# EAGLE design main_board__PT (EAGLE 7.7.0)
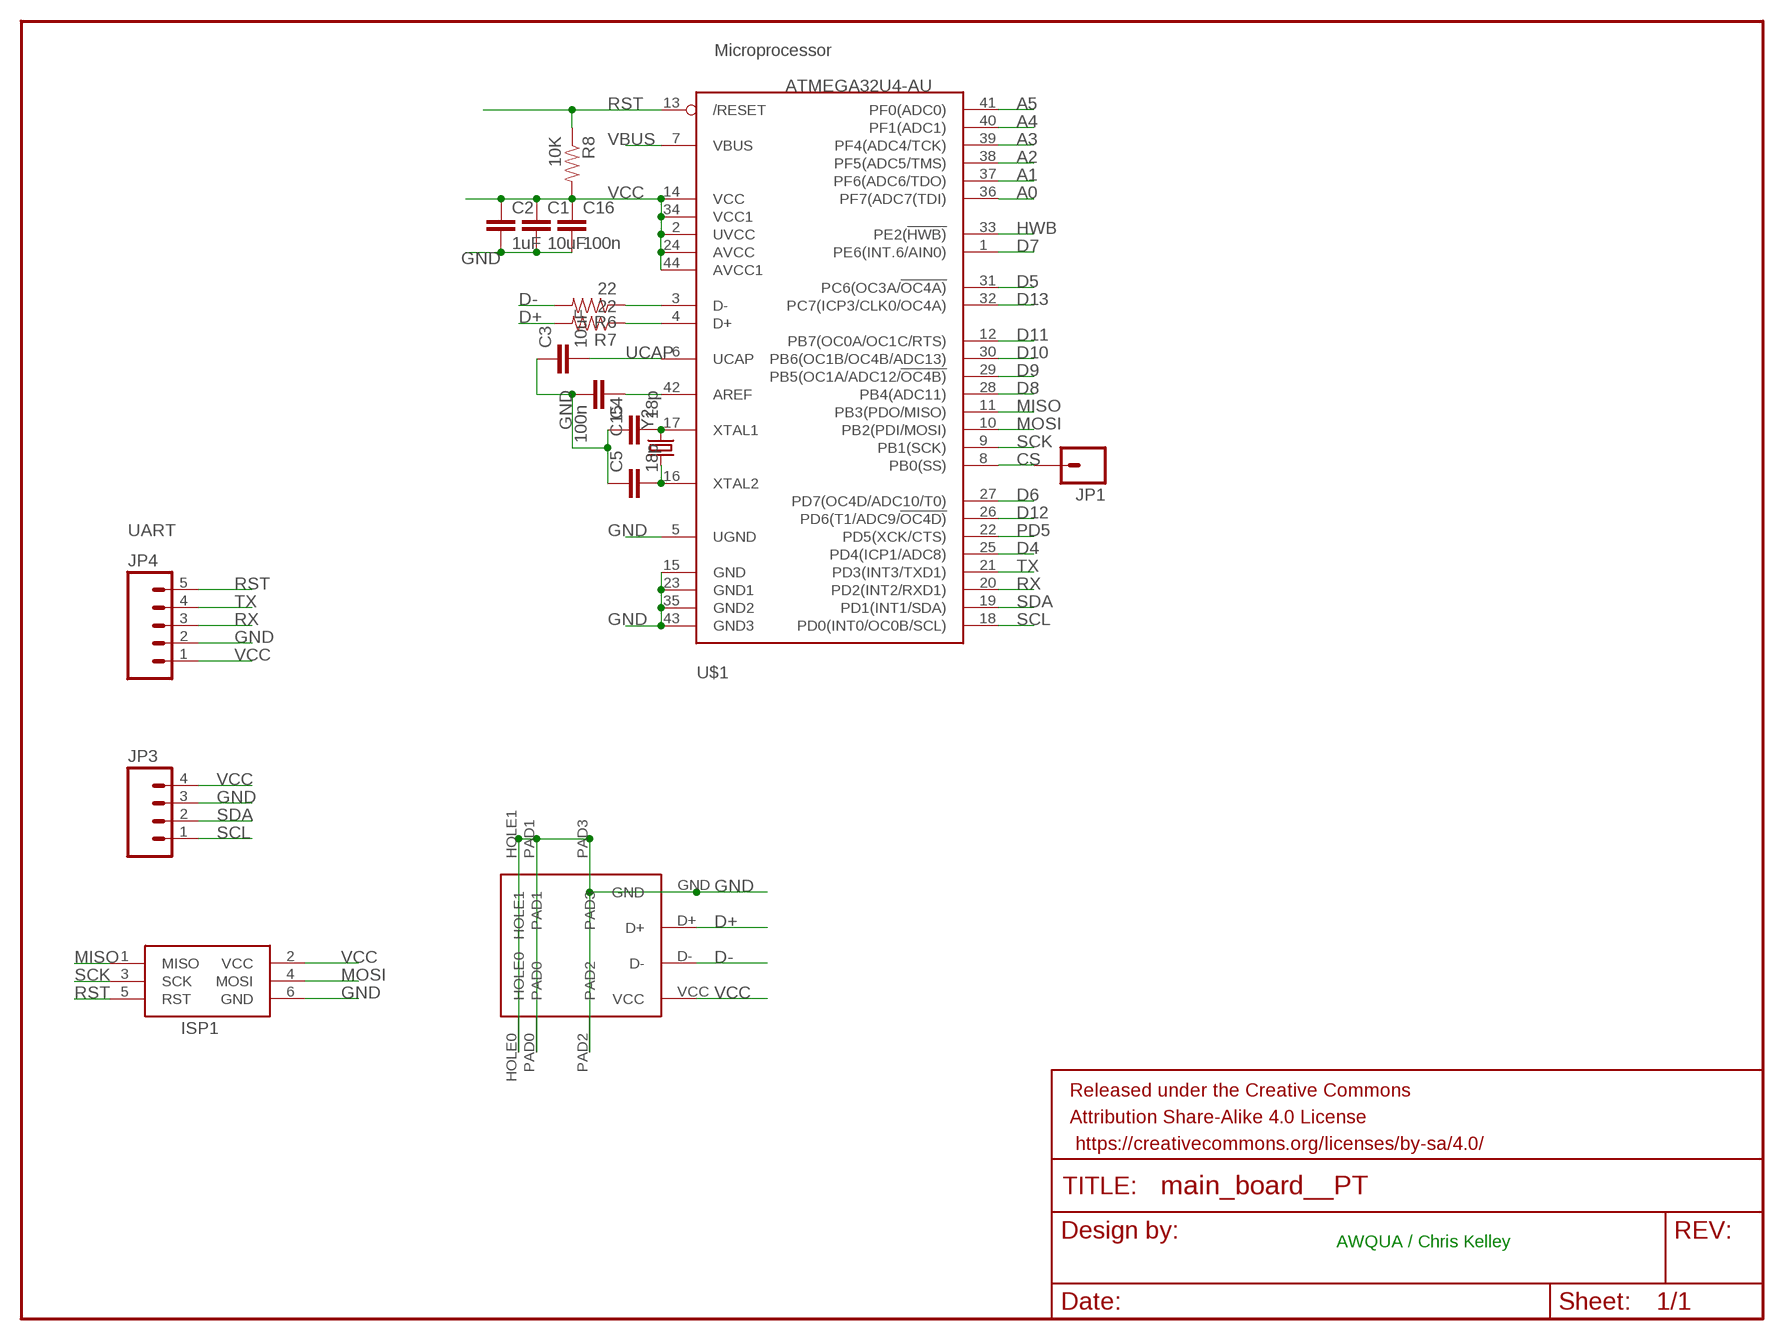
[diagram p0: schematic, sheet 1]

## Parts
C1  10uF  CAP0603-CAP  [0603-CAP]
C2  1uF  CAP0603-CAP  [0603-CAP]
C3  10uF  CAP0603-CAP  [0603-CAP]
C4  18p  CAP0603-CAP  [0603-CAP]
C5  18p  CAP0603-CAP  [0603-CAP]
C15  100n  CAP0603-CAP  [0603-CAP]
C16  100n  CAP0603-CAP  [0603-CAP]
FRAME2  FRAME-LETTER  [CREATIVE_COMMONS]
ISP1  AVRISP-6  [AVRISP]
JP1  M01PTH  [1X01]
JP3  M04PTH  [1X04]
JP4  M05PTH  [1X05]
R6  22  RESISTOR0603  [0603-RES]
R7  22  RESISTOR0603  [0603-RES]
R8  10K  RESISTORPTH-1/6W  [1/6W-RES]
U$1  ATMEGA32U4-AU  [TQFP44]
U$2  USBMICRO-10118193-0001LF  [USBMICRO-10118193-0001LF]
Y2  CRYSTAL5X3  [CRYSTAL-SMD-5X3]

## Nets
A0: U$1.36(PF7(ADC7(TDI))
A1: U$1.37(PF6(ADC6/TDO))
A2: U$1.38(PF5(ADC5/TMS))
A3: U$1.39(PF4(ADC4/TCK))
A4: U$1.40(PF1(ADC1))
A5: U$1.41(PF0(ADC0))
CS: JP1.1 U$1.8(PB0(SS))
D4: U$1.25(PD4(ICP1/ADC8))
D5: U$1.31(PC6(OC3A/!OC4A))
D6: U$1.27(PD7(OC4D/ADC10/T0))
D7: U$1.1(PE6(INT.6/AIN0))
D8: U$1.28(PB4(ADC11))
D9: U$1.29(PB5(OC1A/ADC12/!OC4B))
D10: U$1.30(PB6(OC1B/OC4B/ADC13))
D11: U$1.12(PB7(OC0A/OC1C/RTS))
D12: U$1.26(PD6(T1/ADC9/!OC4D))
D13: U$1.32(PC7(ICP3/CLK0/OC4A))
D+: R7.2 U$2.D+
D-: R6.2 U$2.D-
GND: C1.2 C2.2 C3.1 C4.1 C5.1 C15.2 C16.2 ISP1.6(GND) JP3.3 JP4.2 U$1.5(UGND) U$1.15(GND) U$1.23(GND1) U$1.35(GND2) U$1.43(GND3) U$2.GND U$2.HOLE0 U$2.HOLE1 U$2.PAD0 U$2.PAD1 U$2.PAD2 U$2.PAD3
HWB: U$1.33(PE2(!HWB))
MISO: ISP1.1(MISO) U$1.11(PB3(PDO/MISO))
MOSI: ISP1.4(MOSI) U$1.10(PB2(PDI/MOSI))
N$41: R6.1 U$1.3(D-)
N$42: R7.1 U$1.4(D+)
N$44: C15.1 U$1.42(AREF)
N$45: C4.2 U$1.17(XTAL1) Y2.3
N$46: C5.2 U$1.16(XTAL2) Y2.1
PD5: U$1.22(PD5(XCK/CTS))
RST: ISP1.5(RST) JP4.5 R8.1 U$1.13(/RESET)
RX: JP4.3 U$1.20(PD2(INT2/RXD1))
SCK: ISP1.3(SCK) U$1.9(PB1(SCK))
SCL: JP3.1 U$1.18(PD0(INT0/OC0B/SCL))
SDA: JP3.2 U$1.19(PD1(INT1/SDA))
TX: JP4.4 U$1.21(PD3(INT3/TXD1))
UCAP: C3.2 U$1.6(UCAP)
VBUS: U$1.7(VBUS)
VCC: C1.1 C2.1 C16.1 ISP1.2(VCC) JP3.4 JP4.1 R8.2 U$1.2(UVCC) U$1.14(VCC) U$1.24(AVCC) U$1.34(VCC1) U$1.44(AVCC1) U$2.VCC

## Notes on the sheet
- Microprocessor
- UART
- AWQUA / Chris Kelley

## Library data of the parts
C1-C5 C15 C16 = SparkFun:CAP: Capacitor Standard 0603 ceramic capacitor, and 0.1" leaded capacitor.
FRAME2 = SparkFun-Aesthetics:FRAME-LETTER: Schematic Frame Standard 8.5x11 US Letter frame
ISP1 = adafruit:AVRISP: AVR ISP HEADER Standard 6 pin header for AVR programming
JP1 = SparkFun-Connectors:M01: Header 1 Standard 1-pin 0.1" header. Use with straight break away headers (SKU : PRT-00116), right angle break away headers (PRT-00553), swiss pins (PRT-00743), machine pins (PRT-00117), and female headers (PRT-00115).
JP3 = SparkFun-Connectors:M04: Header 4 Standard 4-pin 0.1" header. Use with straight break away headers (SKU : PRT-00116), right angle break away headers (PRT-00553), swiss pins (PRT-00743), machine pins (PRT-00117), and female headers (PRT-00115). Molex polarized connector foot print use with SKU : PRT-08231 with associated crimp pins and housings. 1MM SMD Version SKU: PRT-10208
JP4 = SparkFun-Connectors:M05: Header 5 Standard 5-pin 0.1" header. Use with straight break away headers (SKU : PRT-00116), right angle break away headers (PRT-00553), swiss pins (PRT-00743), machine pins (PRT-00117), and female headers (PRT-00115). Molex polarized connector foot print use with SKU : PRT-08230 with associated crimp pins and housings.
R6-R8 = SparkFun-Resistors:RESISTOR: Resistor Basic schematic elements and footprints for 0603, 1206, and PTH resistors.
U$1 = adafruit:ATMEGA32U4: http://www.ladyada.net/library/eagle
U$2 = awqua_eagle_library:USBMICRO-10118193-0001LF
Y2 = SparkFun:CRYSTAL: Crystals Various standard crystals. Proven footprints. Spark Fun Electronics SKU : COM-00534

## Board
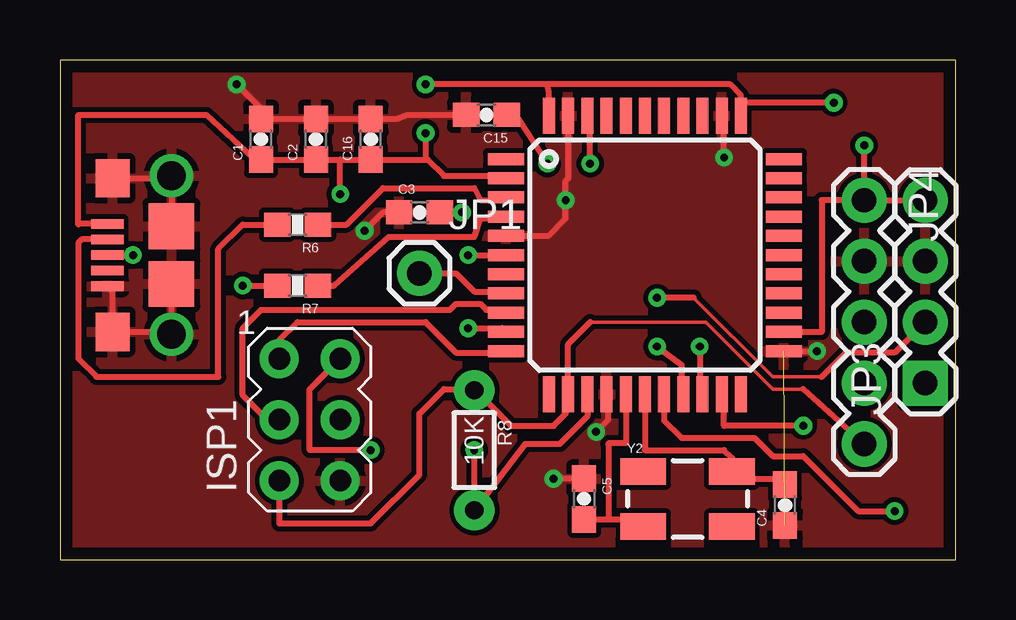
[diagram p1: board, top side]
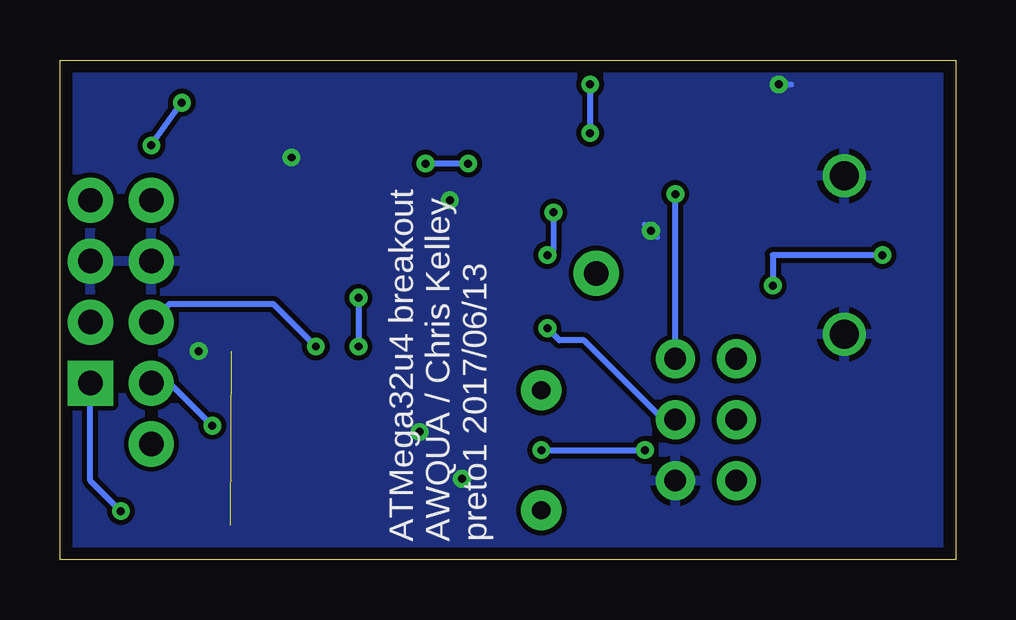
[diagram p2: board, bottom side, seen from below]

Size 37.34 x 20.83 mm. Coordinates in mm from the lower left corner, seen from the top.
Outline: 0,0 37.34,0 37.34,20.83 0,20.83 0,0
Copper layers (1*16): Top 0.035mm / dielectric 1.5mm / Bottom 0.035mm
Design rules "default *": minimum track width 6mil, minimum drill 12mil, track to track 8mil, track to pad 8mil, pad to pad 8mil, via to via 8mil, smd to smd 8mil, copper to edge 20mil, drill to drill 8mil, minimum pad ring 10mil, minimum via ring 8mil, stop-mask expansion 4mil, vias tented up to drill 13mil, thermal gap 10mil

### Footprints (pad centres in the part's own frame; a part is rotated, then mirrored left to right if it is on the bottom)
0603-CAP = smd 1.1 x 1: 1 -0.85,0; 2 0.85,0
AVRISP = drill 0.9 pad 1.626: 1 -1.27,2.54; 2 1.27,2.54; 3 -1.27,0; 4 1.27,0; 5 -1.27,-2.54; 6 1.27,-2.54
1X01 = drill 1.016 pad 1.88: 1 0,0
1X04 = drill 1.016 pad 1.88 square: 1 0,0 | drill 1.016 pad 1.88: 2 2.54,0; 3 5.08,0; 4 7.62,0
1X05 = drill 1.016 pad 1.88: 1 0,0; 2 2.54,0; 3 5.08,0; 4 7.62,0; 5 10.16,0
0603-RES = smd 1.1 x 1: 1 -0.85,0; 2 0.85,0
1/6W-RES = drill 0.762 pad 1.676: 1 -2.5,0; 2 2.5,0
TQFP44 = smd 1.5 x 0.5: 1 -5.8,4; 2 -5.8,3.2; 3 -5.8,2.4; 4 -5.8,1.6; 5 -5.8,0.8; 6 -5.8,0; 7 -5.8,-0.8; 8 -5.8,-1.6; 9 -5.8,-2.4; 10 -5.8,-3.2; 11 -5.8,-4; 23 5.8,-4; 24 5.8,-3.2; 25 5.8,-2.4; 26 5.8,-1.6; 27 5.8,-0.8; 28 5.8,0; 29 5.8,0.8; 30 5.8,1.6; 31 5.8,2.4; 32 5.8,3.2; 33 5.8,4 | smd 0.5 x 1.5: 12 -4,-5.8; 13 -3.2,-5.8; 14 -2.4,-5.8; 15 -1.6,-5.8; 16 -0.8,-5.8; 17 0,-5.8; 18 0.8,-5.8; 19 1.6,-5.8; 20 2.4,-5.8; 21 3.2,-5.8; 22 4,-5.8; 34 4,5.8; 35 3.2,5.8; 36 2.4,5.8; 37 1.6,5.8; 38 0.8,5.8; 39 0,5.8; 40 -0.8,5.8; 41 -1.6,5.8; 42 -2.4,5.8; 43 -3.2,5.8; 44 -4,5.8
USBMICRO-10118193-0001LF = smd 0.4 x 1.35: D+ 0,4.125; D- 0.65,4.125; DNP -0.65,4.125; GND -1.3,4.125; VCC 1.3,4.125 | drill 1.2 pad 1.6: HOLE0 3.3,1.45; HOLE1 -3.3,1.45 | smd 1.9 x 1.9: PAD0 1.2,1.45; PAD1 -1.2,1.45 | smd 1.6 x 1.4: PAD2 3.2,3.9; PAD3 -3.2,3.9
CRYSTAL-SMD-5X3 = smd 1.9 x 1.1: 1 -1.85,-1.15; 2 1.85,-1.15; 3 1.85,1.15; 4 -1.85,1.15

### Placement (x,y rotation side)
C1  8.38,17.53 90 top
C2  10.67,17.53 90 top
C3  14.99,14.48 0 top
C4  30.23,2.29 90 top
C5  21.84,2.54 270 top
C15  17.78,18.54 180 top
C16  12.95,17.53 90 top
FRAME2  -17.02,-19.81 0 top  (outside the outline)
ISP1  10.41,5.84 0 top
JP1  14.99,11.94 0 top
JP3  36.07,7.37 90 top
JP4  33.53,14.99 270 top
R6  9.91,13.97 180 top
R7  9.91,11.43 180 top
R8  17.27,4.57 270 top
U$1  24.38,12.7 0 top
U$2  6.1,12.7 90 top
Y2  26.16,2.54 0 top

### Tracks (layer width: path | path; a pad name or v marks a point on that pad's centre or on a via)
CS
  Top 0.254: JP1.1 16.51,11.94 17.27,11.18 18.51,11.18 U$1.8
D+  (via drill 0.33)
  Top 0.254: U$2.D+ v3.05,12.7 | v7.62,11.43 R7.2
  Bottom 0.254: v3.05,12.7 7.62,12.7 v7.62,11.43
D-
  Top 0.254: U$2.D- 0.9,13.35 0.76,13.21 0.76,8.38 1.52,7.62 6.6,7.62 6.6,12.95 7.62,13.97 R6.2
GND  (via drill 0.33)  (1 unrouted)
  Top 0.254: C5.1 v20.57,3.38 | U$2.PAD2 4.55,15.9 U$2.HOLE0 U$2.PAD0 | U$2.PAD1 U$2.HOLE1 4.55,9.5 U$2.PAD3 2.2,11.18 U$2.GND | C15.2 14.48,18.54 14.06,18.38 C16.2 C2.2 C1.2 8.38,18.8 v7.37,19.81 | U$1.43 21.18,15.9 21.08,15.8 v21.08,14.99 21.08,14.22 20.36,13.5 U$1.5 | v27.69,16.76 27.69,18.4 U$1.35 | U$1.23 v31.56,8.7 | v22.35,5.33 22.86,5.84 22.86,6.82 U$1.15 | C3.1 13.46,14.48 v12.7,13.72
  Bottom 0.254: v31.56,8.7 31.75,8.89 | v7.37,19.81 6.86,19.81 | 12.95,13.97 v12.7,13.72 12.45,13.46
  pour Bottom: -2.03,29.46 45.97,28.96 45.97,-5.84 -2.03,-5.33
  pour Top: -5.33,27.94 42.67,27.43 42.67,-7.37 -5.33,-6.86
MISO
  Top 0.254: ISP1.1 9.14,9.14 9.91,9.91 15.24,9.91 16.51,8.64 18.52,8.64 U$1.11
MOSI  (via drill 0.33)
  Top 0.254: v17.02,9.65 18.43,9.65 U$1.10
  Bottom 0.254: ISP1.4 12.19,5.84 15.49,9.14 16.51,9.14 v17.02,9.65
N$41
  Top 0.254: R6.1 11.94,13.97 13.46,15.49 17.27,15.49 17.53,14.99 18.47,14.99 U$1.3
N$42
  Top 0.254: R7.1 11.43,11.43 13.72,13.46 17.27,13.46 17.53,14.22 18,14.22 U$1.4
N$44  (via drill 0.33)
  Top 0.254: C15.1 18.88,18.71 v20.32,16.51 | v22.1,16.51 22.1,18.39 U$1.42
  Bottom 0.254: v20.32,16.51 v22.1,16.51
N$45
  Top 0.254: U$1.17 24.38,4.57 27.69,4.57 28.01,4.25 Y2.3 28.31,3.39 29.97,3.39 C4.2
N$46
  Top 0.254: U$1.16 23.58,4.86 22.9,4.86 22.86,4.83 22.86,1.69 | C5.2 22.86,1.69 | 22.86,1.69 24.01,1.69 Y2.1
RST
  Top 0.152: 22.1,9.91 26.92,9.91 29.72,7.11 30.99,7.11
  Top 0.254: ISP1.5 9.14,1.52 12.95,1.52 14.99,3.56 14.99,6.1 16,7.11 17.23,7.11 R8.1 17.27,7.11 18.8,5.59 20.57,5.59 21.08,6.1 21.08,6.8 U$1.13 21.18,8.99 22.1,9.91 | 30.99,7.11 JP4.5
RX  (via drill 0.33)
  Top 0.254: v26.67,8.89 26.67,7.01 U$1.20
  Bottom 0.254: JP4.3 32.77,10.67 28.45,10.67 v26.67,8.89
SCK
  Top 0.254: ISP1.3 8.64,5.84 7.62,6.86 7.62,9.65 8.38,10.41 16.26,10.41 16.51,10.67 17.53,10.67 17.78,10.41 18.47,10.41 U$1.9
SCL  (via drill 0.33)
  Top 0.254: U$1.18 25.18,5.8 25.91,5.08 28.96,5.08 29.72,4.32 30.99,4.32 33.27,2.03 v34.8,2.03
  Bottom 0.254: v34.8,2.03 36.07,3.3 JP3.1
SDA  (via drill 0.33)
  Top 0.152: 31.75,7.62 29.72,7.62 26.42,10.92
  Top 0.254: JP3.2 34.8,8.64 32.77,8.64 31.75,7.62 | U$1.19 25.91,6.98 25.91,8.13 v24.89,8.89 | 26.42,10.92 v24.89,10.92
  Bottom 0.254: v24.89,10.92 v24.89,8.89
TX  (via drill 0.33)
  Top 0.254: v30.99,5.59 27.69,5.59 27.69,6.8 U$1.21
  Bottom 0.254: JP4.4 32.77,7.37 v30.99,5.59
UCAP  (via drill 0.33)
  Top 0.254: C3.2 v16.76,14.48 | v17.02,12.7 U$1.6
  Bottom 0.254: v16.76,14.48 16.76,12.95 v17.02,12.7
VCC  (via drill 0.33)
  Top 0.254: U$2.VCC 0.79,14 0.76,13.97 0.76,18.54 6.1,18.54 8.04,16.76 C1.1 | C1.1 C2.1 11.68,16.68 | 8.64,16.42 C1.1 | 11.68,16.68 C16.1 15.33,16.68 | 15.33,16.68 16,16 18.48,16 U$1.2 | JP4.1 v33.53,17.27 | v32.26,19.05 28.45,19.05 28.45,18.54 28.43,18.54 U$1.34 28.38,19.37 27.94,19.81 20.32,19.81 | 20.32,19.81 v15.24,19.81 | U$1.24 31.75,9.5 31.75,14.99 JP4.1 | U$1.14 21.98,5.98 20.83,4.83 19.39,4.83 R8.2 v17.27,4.57 | v12.95,4.57 10.41,4.57 10.41,7.11 ISP1.2 | v11.68,15.24 11.68,16.68 | JP4.1 JP3.4 | v15.24,17.78 15.24,16.76 15.33,16.68 | U$1.44 20.38,19.49 20.32,19.81
  Bottom 0.254: v33.53,17.27 v32.26,19.05 | v17.27,4.57 v12.95,4.57 | ISP1.2 v11.68,15.24 | v15.24,19.81 v15.24,17.78

### Text on the board
tNames: AWQUA / Chris Kelley
bNames: ATMega32u4 breakout / AWQUA / Chris Kelley / preto1 2017/06/13